# EAGLE design SaltwatersEchoCore (EAGLE 9.6.2)
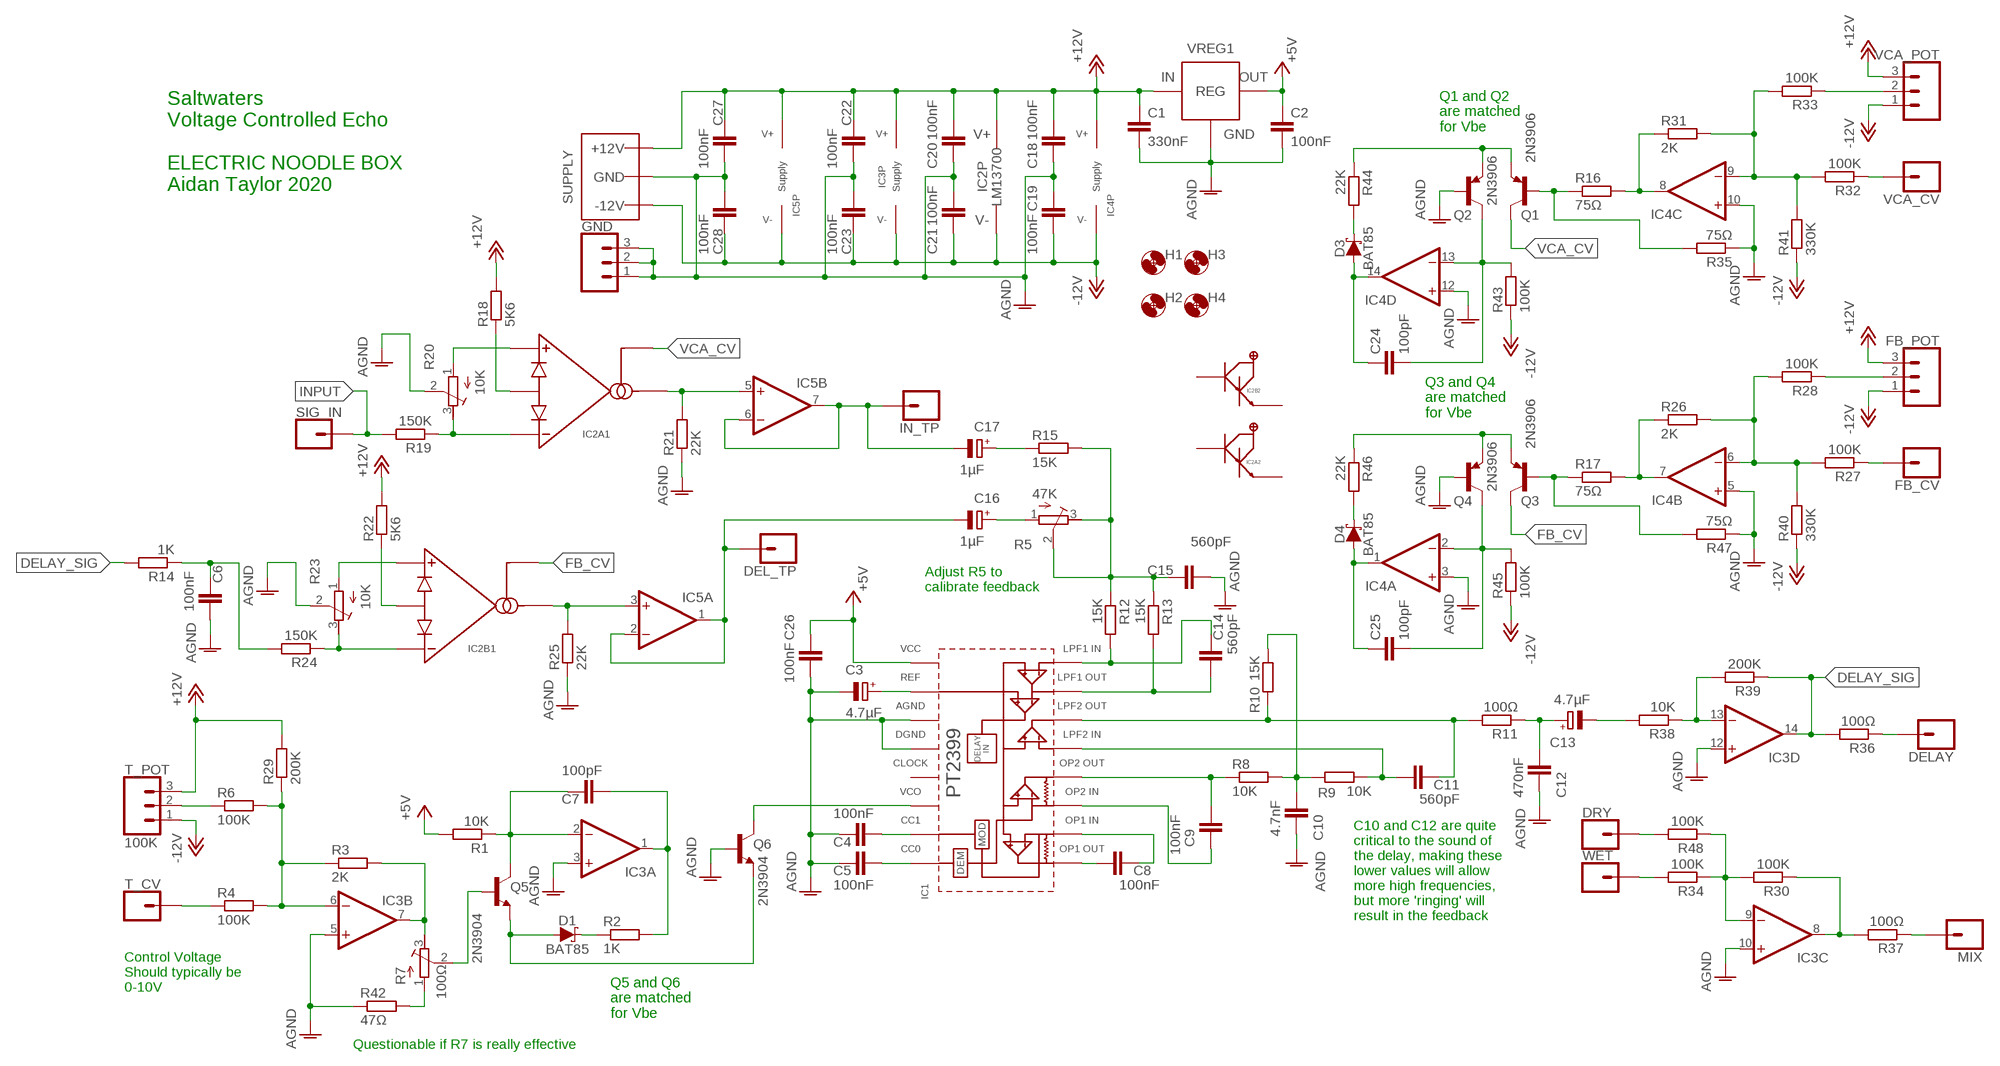
[diagram p0: schematic, sheet 1]

## Parts
C1  330nF  C-EU050-025X075  [C050-025X075]
C2  100nF  C-EU050-025X075  [C050-025X075]
C3  4.7µF  CPOL-EUE2-5  [E2-5]
C4  100nF  C-EU050-025X075  [C050-025X075]
C5  100nF  C-EU050-025X075  [C050-025X075]
C6  100nF  C-EU050-025X075  [C050-025X075]
C7  100pF  C-EU050-025X075  [C050-025X075]
C8  100nF  C-EU050-025X075  [C050-025X075]
C9  100nF  C-EU050-025X075  [C050-025X075]
C10  4.7nF  C-EU050-025X075  [C050-025X075]
C11  560pF  C-EU050-025X075  [C050-025X075]
C12  470nF  C-EU050-025X075  [C050-025X075]
C13  4.7µF  CPOL-EUE2-5  [E2-5]
C14  560pF  C-EU050-025X075  [C050-025X075]
C15  560pF  C-EU050-025X075  [C050-025X075]
C16  1µF  CPOL-EUE2-5  [E2-5]
C17  1µF  CPOL-EUE2-5  [E2-5]
C18  100nF  C-EU050-025X075  [C050-025X075]
C19  100nF  C-EU050-025X075  [C050-025X075]
C20  100nF  C-EU050-025X075  [C050-025X075]
C21  100nF  C-EU050-025X075  [C050-025X075]
C22  100nF  C-EU050-025X075  [C050-025X075]
C23  100nF  C-EU050-025X075  [C050-025X075]
C24  100pF  C-EU050-025X075  [C050-025X075]
C25  100pF  C-EU050-025X075  [C050-025X075]
C26  100nF  C-EU050-025X075  [C050-025X075]
C27  100nF  C-EU050-025X075  [C050-025X075]
C28  100nF  C-EU050-025X075  [C050-025X075]
D1  BAT85  SCHOTTKY_DO35  [DO35-7]
D3  BAT85  SCHOTTKY_DO35  [DO35-7]
D4  BAT85  SCHOTTKY_DO35  [DO35-7]
DEL_TP  1XWIREPAD  [1X01]
DELAY  1XWIREPAD  [1X01]
DRY  1XWIREPAD  [1X01]
FB_CV  1XWIREPAD  [1X01]
FB_POT  3XWIREPAD  [1X03]
GND  3XWIREPAD  [1X03]
H1  MOUNT-HOLE3.2  [3,2]
H2  MOUNT-HOLE3.2  [3,2]
H3  MOUNT-HOLE3.2  [3,2]
H4  MOUNT-HOLE3.2  [3,2]
IC1  PT2399DIL16  [DIL16]
IC2  LM13700DIL  [DIL16]
IC3  TL0X4DIL  [DIL14]
IC4  TL0X4DIL  [DIL14]
IC5  TL0X2DIL  [DIL08]
IN_TP  1XWIREPAD  [1X01]
MIX  1XWIREPAD  [1X01]
Q1  2N3906  [TO92]
Q2  2N3906  [TO92]
Q3  2N3906  [TO92]
Q4  2N3906  [TO92]
Q5  2N3904  [TO92]
Q6  2N3904  [TO92]
R1  10K  R-EU_0207/10  [0207/10]
R2  1K  R-EU_0207/10  [0207/10]
R3  2K  R-EU_0207/10  [0207/10]
R4  100K  R-EU_0207/10  [0207/10]
R5  47K  R-TRIMM3296W  [RTRIM3296W]
R6  100K  R-EU_0207/10  [0207/10]
R7  100Ω  R-TRIMM3296W  [RTRIM3296W]
R8  10K  R-EU_0207/10  [0207/10]
R9  10K  R-EU_0207/10  [0207/10]
R10  15K  R-EU_0207/10  [0207/10]
R11  100Ω  R-EU_0207/10  [0207/10]
R12  15K  R-EU_0207/10  [0207/10]
R13  15K  R-EU_0207/10  [0207/10]
R14  1K  R-EU_0207/10  [0207/10]
R15  15K  R-EU_0207/10  [0207/10]
R16  75Ω  R-EU_0207/10  [0207/10]
R17  75Ω  R-EU_0207/10  [0207/10]
R18  5K6  R-EU_0207/10  [0207/10]
R19  150K  R-EU_0207/10  [0207/10]
R20  10K  R-TRIMM3296W  [RTRIM3296W]
R21  22K  R-EU_0207/10  [0207/10]
R22  5K6  R-EU_0207/10  [0207/10]
R23  10K  R-TRIMM3296W  [RTRIM3296W]
R24  150K  R-EU_0207/10  [0207/10]
R25  22K  R-EU_0207/10  [0207/10]
R26  2K  R-EU_0207/10  [0207/10]
R27  100K  R-EU_0207/10  [0207/10]
R28  100K  R-EU_0207/10  [0207/10]
R29  200K  R-EU_0207/10  [0207/10]
R30  100K  R-EU_0207/10  [0207/10]
R31  2K  R-EU_0207/10  [0207/10]
R32  100K  R-EU_0207/10  [0207/10]
R33  100K  R-EU_0207/10  [0207/10]
R34  100K  R-EU_0207/10  [0207/10]
R35  75Ω  R-EU_0207/10  [0207/10]
R36  100Ω  R-EU_0207/10  [0207/10]
R37  100Ω  R-EU_0207/10  [0207/10]
R38  10K  R-EU_0207/10  [0207/10]
R39  200K  R-EU_0207/10  [0207/10]
R40  330K  R-EU_0207/10  [0207/10]
R41  330K  R-EU_0207/10  [0207/10]
R42  47Ω  R-EU_0207/10  [0207/10]
R43  100K  R-EU_0207/10  [0207/10]
R44  22K  R-EU_0207/10  [0207/10]
R45  100K  R-EU_0207/10  [0207/10]
R46  22K  R-EU_0207/10  [0207/10]
R47  75Ω  R-EU_0207/10  [0207/10]
R48  100K  R-EU_0207/10  [0207/10]
SIG_IN  1XWIREPAD  [1X01]
T_CV  1XWIREPAD  [1X01]
T_POT  100K  3XWIREPAD  [1X03]
VCA_CV  1XWIREPAD  [1X01]
VCA_POT  3XWIREPAD  [1X03]
VREG1  L78L05TO92  [TO92]
WET  1XWIREPAD  [1X01]
WP1  COMBO_SUPPLY_HEADER  [COMBINED_POWER]

## Nets
+5V: C2.1 C26.1 IC1.1(VCC) R1.2 VREG1.1(VOUT)
+12V: C1.1 C18.2 C20.2 C22.2 C27.2 FB_POT.3 IC2.11(P:V+) IC3.4(P:V+) IC4.4(P:V+) IC5.8(P:V+) R18.2 R22.2 R29.2 T_POT.3 VCA_POT.3 VREG1.3(VIN) WP1.V+1(V++) WP1.V+2(V++) WP1.V+3(V++)
-12V: C19.1 C21.1 C23.1 C28.1 FB_POT.1 IC2.6(P:V-) IC3.11(P:V-) IC4.11(P:V-) IC5.4(P:V-) R40.1 R41.1 R43.1 R45.1 T_POT.1 VCA_POT.1 WP1.V-1(V--) WP1.V-2(V--) WP1.V-3(V--)
AGND: C1.2 C2.2 C3.- C4.2 C5.2 C6.2 C10.1 C12.1 C15.2 C18.1 C19.2 C20.1 C21.2 C22.1 C23.2 C26.2 C27.1 C28.2 GND.1 GND.2 GND.3 IC1.3(AGND) IC1.4(DGND) IC3.3(A:+IN) IC3.5(B:+IN) IC3.10(C:+IN) IC3.12(D:+IN) IC4.3(A:+IN) IC4.5(B:+IN) IC4.10(C:+IN) IC4.12(D:+IN) Q2.2(B) Q4.2(B) Q6.2(B) R20.2(S) R21.1 R23.2(S) R25.1 R35.1 R42.1 R47.1 VREG1.2(GND) WP1.GND1(AGND) WP1.GND2(AGND) WP1.GND3(AGND) WP1.GND4(AGND) WP1.GND5(AGND) WP1.GND6(AGND) WP1.GND7(AGND) WP1.GND8(AGND)
DELAY_SIG: IC3.14(D:OUT) R14.2 R36.2 R39.1
FB_CV: IC2.16(B1:AMPBIAS) Q3.1(C)
FB_RTN: C16.- DEL_TP.1 IC5.1(A:OUT) IC5.2(A:-IN)
INPUT: R19.2 SIG_IN.1
N$1: C3.+ IC1.2(REF)
N$2: C4.1 IC1.7(CC1)
N$3: C5.1 IC1.8(CC0)
N$4: IC1.6(VCO) Q6.1(C)
N$5: C7.2 IC3.2(A:-IN) Q5.1(C) R1.1
N$6: C7.1 IC3.1(A:OUT) R2.2
N$7: D1.A Q5.3(E) Q6.3(E)
N$8: C6.1 R14.1 R24.2
N$9: D1.C R2.1
N$10: IC3.7(B:OUT) R3.2 R7.3(E)
N$11: Q5.2(B) R7.2(S)
N$12: R4.1 T_CV.1
N$13: IC3.6(B:-IN) R3.1 R4.2 R6.2 R29.1
N$14: R6.1 T_POT.2
N$15: C8.1 IC1.10(OP1_IN)
N$16: C8.2 IC1.9(OP1_OUT)
N$17: C9.1 IC1.11(OP2_IN)
N$18: C9.2 IC1.12(OP2_OUT) R8.1
N$19: C10.2 R8.2 R9.2 R10.1
N$20: C11.2 IC1.13(LPF2_IN) R9.1
N$21: C11.1 IC1.14(LPF2_OUT) R10.2 R11.2
N$22: Q1.2(B) R16.1 R35.2
N$23: C12.2 C13.+ R11.1
N$24: C14.1 IC1.16(LPF1_IN) R12.2
N$25: C14.2 IC1.15(LPF1_OUT) R13.2
N$26: C15.1 R5.2(S) R5.3(E) R12.1 R13.1 R15.2
N$27: C17.+ R15.1
N$28: C16.+ R5.1(A)
N$29: IC2.4(A1:AMP-) R19.1 R20.3(E)
N$30: IC2.3(A1:AMP+) R20.1(A)
N$31: IC4.7(B:OUT) R17.2 R26.1
N$32: IC2.2(A1:DIODES) R18.1
N$33: IC2.5(A1:AMPOUT) IC5.5(B:+IN) R21.2
N$34: C17.- IC5.6(B:-IN) IC5.7(B:OUT) IN_TP.1
N$35: DELAY.1 R36.1
N$36: IC2.15(B1:DIODES) R22.1
N$37: IC2.13(B1:AMP-) R23.3(E) R24.1
N$38: IC2.14(B1:AMP+) R23.1(A)
N$39: IC4.6(B:-IN) R26.2 R27.2 R28.2 R40.2
N$40: IC2.12(B1:AMPOUT) IC5.3(A:+IN) R25.2
N$41: Q3.2(B) R17.1 R47.2
N$42: DRY.1 R48.2
N$43: FB_CV.1 R27.1
N$44: IC4.8(C:OUT) R16.2 R31.1
N$45: FB_POT.2 R28.1
N$46: IC4.9(C:-IN) R31.2 R32.2 R33.2 R41.2
N$47: C24.1 D3.A IC4.14(D:OUT)
N$48: C24.2 IC4.13(D:-IN) Q2.1(C) R43.2
N$49: R32.1 VCA_CV.1
N$50: R33.1 VCA_POT.2
N$51: C13.- R38.2
N$52: R34.2 WET.1
N$53: MIX.1 R37.1
N$54: R7.1(A) R42.2
N$55: IC3.9(C:-IN) R30.2 R34.1 R48.1
N$56: IC3.8(C:OUT) R30.1 R37.2
N$57: D3.C R44.2
N$58: Q1.3(E) Q2.3(E) R44.1
N$59: IC3.13(D:-IN) R38.1 R39.2
N$60: C25.2 IC4.2(A:-IN) Q4.1(C) R45.2
N$61: C25.1 D4.A IC4.1(A:OUT)
N$62: D4.C R46.2
N$63: Q3.3(E) Q4.3(E) R46.1
VCA_CV: IC2.1(A1:AMPBIAS) Q1.1(C)
Unconnected: IC1.5(CLOCK) IC2.7(A2:BUFF_IN) IC2.8(A2:BUFF_OUT) IC2.9(B2:BUFF_OUT) IC2.10(B2:BUFF_IN)

## Notes on the sheet
- Saltwaters
  Voltage Controlled Echo
  
  ELECTRIC NOODLE BOX
  Aidan Taylor 2020
- Q1 and Q2
  are matched
  for Vbe
- Q3 and Q4
  are matched
  for Vbe
- Adjust R5 to
  calibrate feedback
- C10 and C12 are quite 
  critical to the sound of 
  the delay, making these
  lower values will allow
  more high frequencies,
  but more 'ringing' will
  result in the feedback
- Q5 and Q6
  are matched
  for Vbe
- Control Voltage
  Should typically be
  0-10V
- Questionable if R7 is really effective

## Library data of the parts
C1 C2 C4-C12 C14 C15 C18-C28 = rcl:C-EU: CAPACITOR, European symbol; SPICEPREFIX: C
C3 C13 C16 C17 = rcl:CPOL-EU: POLARIZED CAPACITOR, European symbol; SPICEPREFIX: C
D1 D3 D4 = ElectricNoodleBox:SCHOTTKY_DO35
DEL_TP DELAY DRY FB_CV IN_TP MIX SIG_IN T_CV VCA_CV WET = ElectricNoodleBox:1XWIREPAD
FB_POT GND T_POT VCA_POT = ElectricNoodleBox:3XWIREPAD
H1-H4 = holes:MOUNT-HOLE: MOUNTING HOLE with drill center marker
IC1 = ElectricNoodleBox:PT2399
IC2 = ElectricNoodleBox:LM13700: Dual Transconductance Amplifier with Darlington Buffer; CATALOGUE: 3118206; RETAILER: Farnell
IC3 IC4 = ElectricNoodleBox:TL0X4: Quad Operational Amplifier; CATALOGUE: 3005140; RETAILER: Farnell
IC5 = ElectricNoodleBox:TL0X2: Dual Operational Amplifier; CATALOGUE: 1103189; RETAILER: Farnell
Q1-Q4 = transistor-pnp:2N3906: PNP Transistor
Q5 Q6 = transistor:2N3904: NPN TRANSISTOR
R1-R4 R6 R8-R19 R21 R22 R24-R48 = rcl:R-EU_: RESISTOR, European symbol; SPICEPREFIX: R
R5 R7 R20 R23 = rcl:R-TRIMM: Trimm resistor; SPICEMODEL: X; SPICEPREFIXL: POT
VREG1 = ElectricNoodleBox:L78L05
WP1 = ElectricNoodleBox:COMBO_SUPPLY_HEADER

## Board
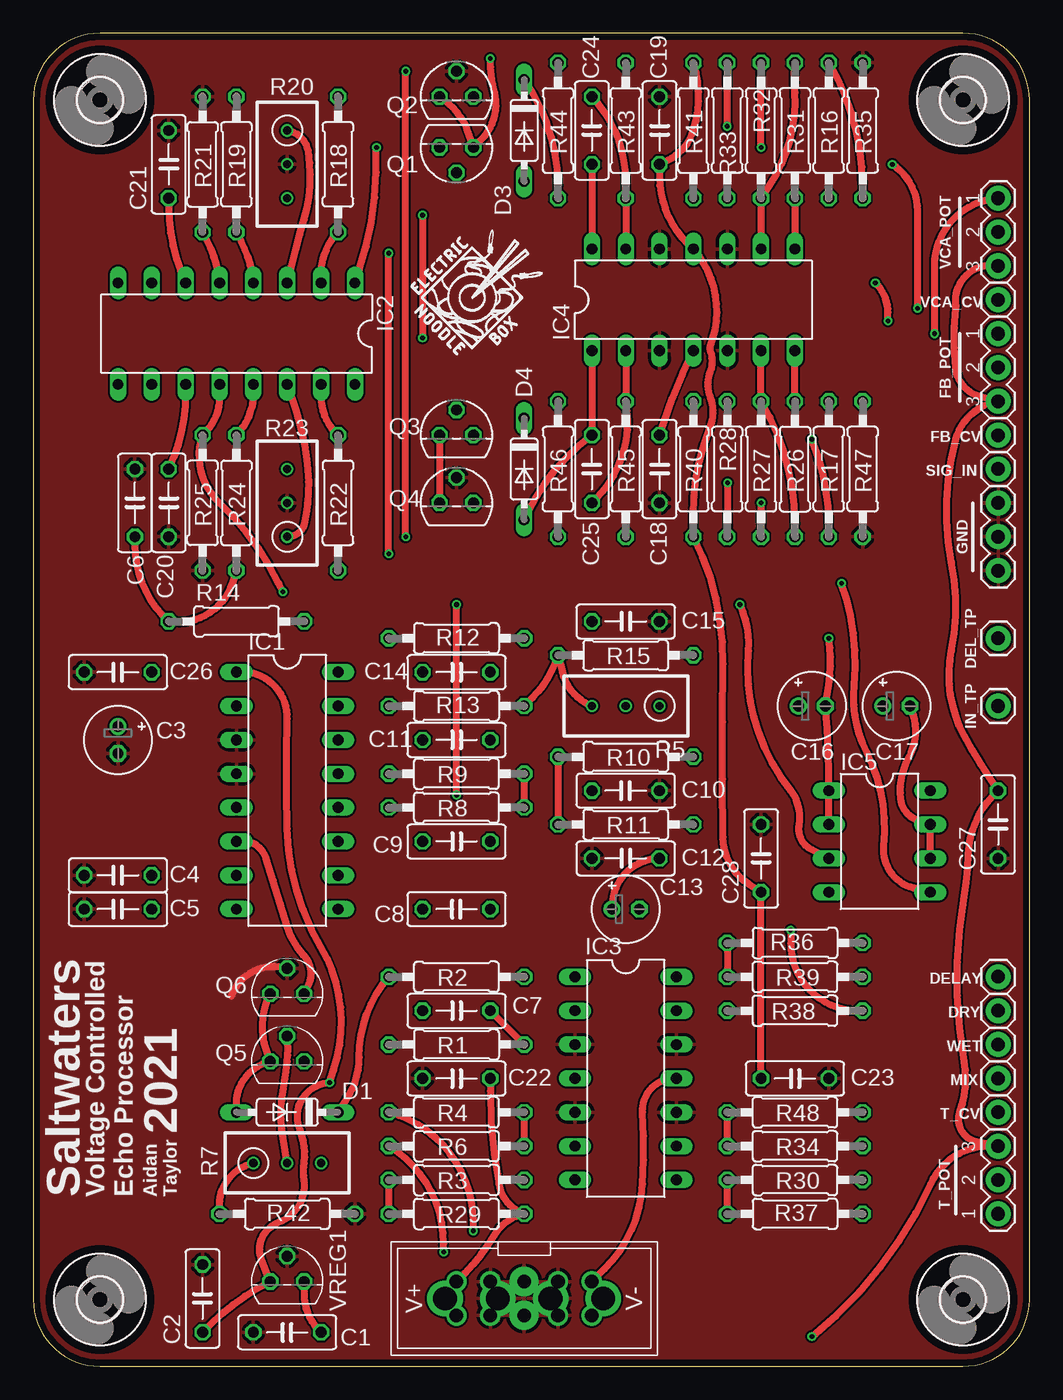
[diagram p1: board, top side]
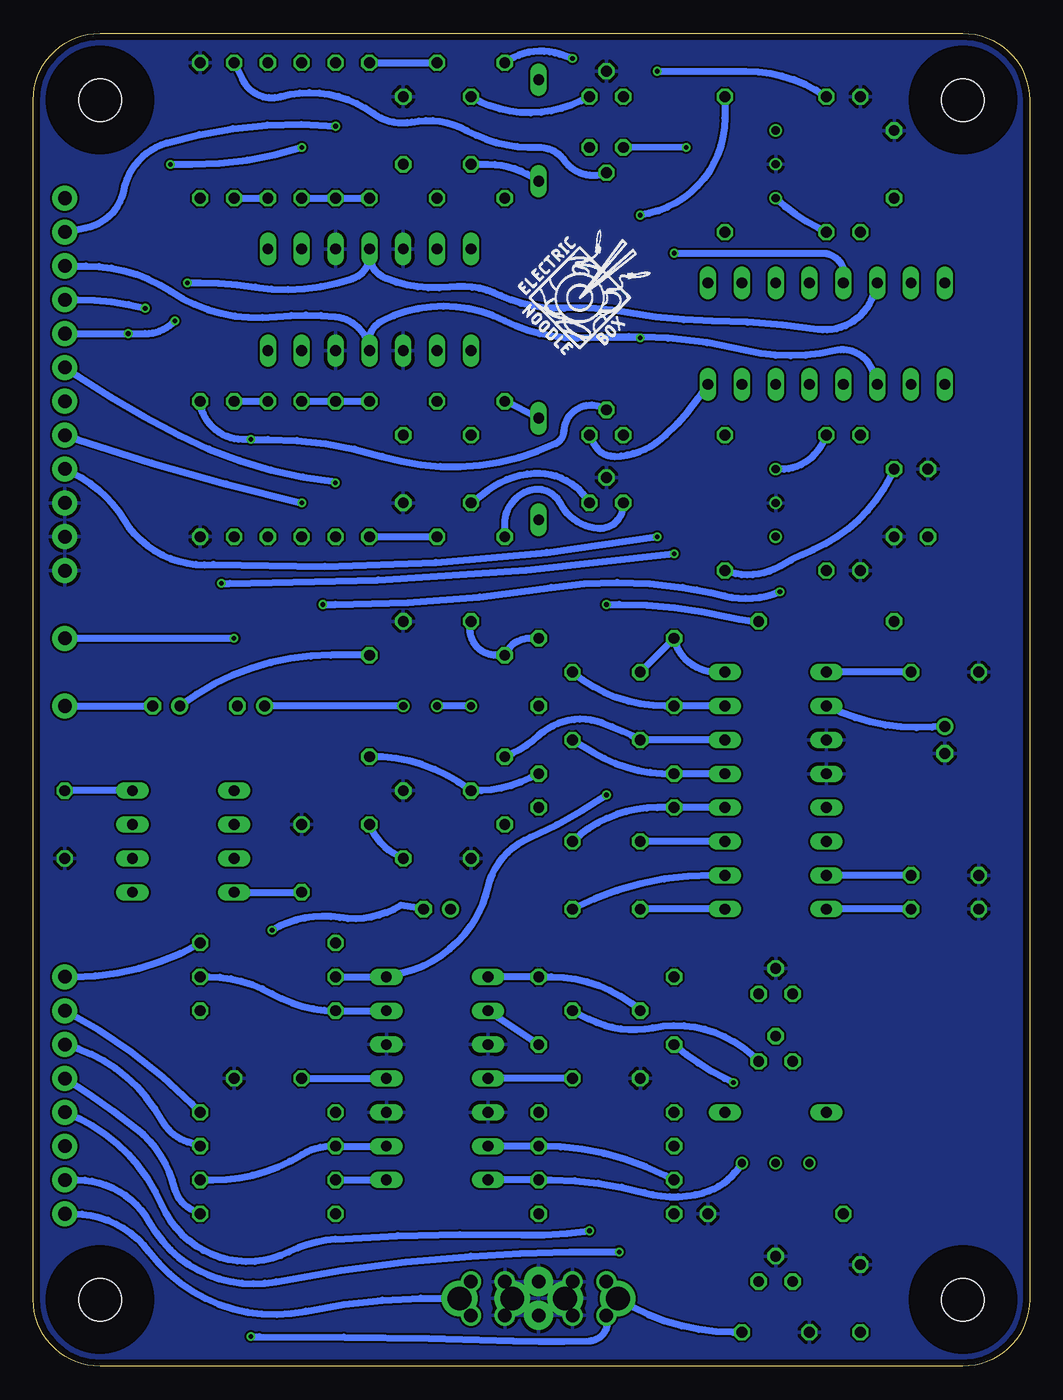
[diagram p2: board, bottom side, seen from below]

Size 74.75 x 100 mm. Coordinates in mm from the lower left corner, seen from the top.
Outline: 0,95 0,5 arc90 5,0 69.75,0 arc90 74.75,5 74.75,95 arc90 69.75,100 5,100 arc90 0,95
Copper layers (1*16): Top 0.035mm / dielectric 1.6mm / Bottom 0.035mm
Design rules "Elecrow_2-layer_PCB_eagle_rule": minimum track width 6mil, minimum drill 12mil, track to track 6mil, track to pad 6mil, pad to pad 6mil, via to via 8mil, smd to smd 0mil, copper to edge 20mil, drill to drill 10mil, minimum pad ring 6mil, minimum via ring 6mil, stop-mask expansion 0mil, vias tented up to drill 100mil, thermal gap 10mil

### Footprints (pad centres in the part's own frame; a part is rotated, then mirrored left to right if it is on the bottom)
C050-025X075 = drill 0.813 octagon: 1 -2.54,0; 2 2.54,0
E2-5 = drill 0.813 pad 1.27: + -1.016,0 | drill 0.813 pad 1.27 octagon: - 1.016,0
DO35-7 = drill 0.813 long: A 3.81,0; C -3.81,0
1X01 = drill 1.016 pad 1.88: 1 0,0
1X03 = drill 1.016 pad 1.88: 1 0,0; 2 2.54,0; 3 5.08,0
3,2 = hole 3.2: 0,0
DIL16 = drill 0.813 long: 1 -8.89,-3.81; 2 -6.35,-3.81; 3 -3.81,-3.81; 4 -1.27,-3.81; 5 1.27,-3.81; 6 3.81,-3.81; 7 6.35,-3.81; 8 8.89,-3.81; 9 8.89,3.81; 10 6.35,3.81; 11 3.81,3.81; 12 1.27,3.81; 13 -1.27,3.81; 14 -3.81,3.81; 15 -6.35,3.81; 16 -8.89,3.81
DIL14 = drill 0.813 long: 1 -7.62,-3.81; 2 -5.08,-3.81; 3 -2.54,-3.81; 4 0,-3.81; 5 2.54,-3.81; 6 5.08,-3.81; 7 7.62,-3.81; 8 7.62,3.81; 9 5.08,3.81; 10 2.54,3.81; 11 0,3.81; 12 -2.54,3.81; 13 -5.08,3.81; 14 -7.62,3.81
DIL08 = drill 0.813 long: 1 -3.81,-3.81; 2 -1.27,-3.81; 3 1.27,-3.81; 4 3.81,-3.81; 5 3.81,3.81; 6 1.27,3.81; 7 -1.27,3.81; 8 -3.81,3.81
TO92 = drill 0.813 octagon: 1 1.27,0; 2 0,1.905; 3 -1.27,0
0207/10 = drill 0.813 octagon: 1 -5.08,0; 2 5.08,0
RTRIM3296W = drill 0.61: 1 0,-2.54; 2 0,0; 3 0,2.54
TO92' = drill 0.813 octagon: 1 -1.27,0; 2 0,1.905; 3 1.27,0
COMBINED_POWER = drill 1.78: GND1 -1.98,0; GND2 1.98,0; V+1 -5.94,0; V-1 5.94,0 | drill 1.016: GND3 -2.54,1.27; GND5 2.54,1.27; GND6 -2.54,-1.27; GND8 2.54,-1.27; V+2 -5.08,1.27; V+3 -5.08,-1.27; V-2 5.08,1.27; V-3 5.08,-1.27 | drill 1.016 pad 2.184: GND4 0,1.27; GND7 0,-1.27

### Placement (x,y rotation side)
C1  19.05,2.54 180 top
C2  12.7,5.08 90 top
C3  6.35,46.99 270 top
C4  6.35,36.83 180 top
C5  6.35,34.29 180 top
C6  7.62,64.77 90 top
C7  31.75,26.67 0 top
C8  31.75,34.29 180 top
C9  31.75,39.37 0 top
C10  44.45,43.18 180 top
C11  31.75,46.99 0 top
C12  44.45,38.1 0 top
C13  44.45,34.29 0 top
C14  31.75,52.07 0 top
C15  44.45,55.88 0 top
C16  58.42,49.53 0 top
C17  64.77,49.53 0 top
C18  46.99,67.31 90 top
C19  46.99,92.71 90 top
C20  10.16,64.77 90 top
C21  10.16,90.17 90 top
C22  31.75,21.59 0 top
C23  57.15,21.59 0 top
C24  41.91,92.71 90 top
C25  41.91,67.31 270 top
C26  6.35,52.07 180 top
C27  72.39,40.64 90 top
C28  54.61,38.1 90 top
D1  19.05,19.05 180 top
D3  36.83,92.71 270 top
D4  36.83,67.31 270 top
DEL_TP  72.39,54.61 0 top
DELAY  72.39,29.21 0 top
DRY  72.39,26.67 0 top
FB_CV  72.39,69.85 0 top
FB_POT  72.39,77.47 270 top
GND  72.39,64.77 270 top
H1  69.75,95 0 top
H2  5,95 0 top
H3  69.75,5 0 top
H4  5,5 0 top
IC1  19.05,43.18 270 top
IC2  15.24,77.47 180 top
IC3  44.45,21.59 270 top
IC4  49.53,80.01 0 top
IC5  63.5,39.37 270 top
IN_TP  72.39,49.53 0 top
MIX  72.39,21.59 0 top
Q1  31.75,91.44 180 top
Q2  31.75,95.25 0 top
Q3  31.75,69.85 0 top
Q4  31.75,64.77 0 top
Q5  19.05,22.86 0 top
Q6  19.05,27.94 0 top
R1  31.75,24.13 180 top
R2  31.75,29.21 0 top
R3  31.75,13.97 0 top
R4  31.75,19.05 0 top
R5  44.45,49.53 90 top
R6  31.75,16.51 0 top
R7  19.05,15.24 270 top
R8  31.75,41.91 0 top
R9  31.75,44.45 0 top
R10  44.45,45.72 180 top
R11  44.45,40.64 180 top
R12  31.75,54.61 180 top
R13  31.75,49.53 180 top
R14  15.24,55.88 0 top
R15  44.45,53.34 180 top
R16  59.69,92.71 270 top
R17  59.69,67.31 90 top
R18  22.86,90.17 90 top
R19  15.24,90.17 90 top
R20  19.05,90.17 180 top
R21  12.7,90.17 270 top
R22  22.86,64.77 270 top
R23  19.05,64.77 0 top
R24  15.24,64.77 270 top
R25  12.7,64.77 90 top
R26  57.15,67.31 270 top
R27  54.61,67.31 90 top
R28  52.07,67.31 90 top
R29  31.75,11.43 0 top
R30  57.15,13.97 0 top
R31  57.15,92.71 90 top
R32  54.61,92.71 270 top
R33  52.07,92.71 270 top
R34  57.15,16.51 0 top
R35  62.23,92.71 270 top
R36  57.15,31.75 180 top
R37  57.15,11.43 180 top
R38  57.15,26.67 0 top
R39  57.15,29.21 0 top
R40  49.53,67.31 90 top
R41  49.53,92.71 270 top
R42  19.05,11.43 180 top
R43  44.45,92.71 270 top
R44  39.37,92.71 270 top
R45  44.45,67.31 90 top
R46  39.37,67.31 90 top
R47  62.23,67.31 90 top
R48  57.15,19.05 0 top
SIG_IN  72.39,67.31 0 top
T_CV  72.39,19.05 0 top
T_POT  72.39,11.43 90 top
U$1  [LOGO10X10]  28.26,75.56 0 top
U$2  [LOGO10X10]  38.42,75.56 0 bottom
VCA_CV  72.39,80.01 0 top
VCA_POT  72.39,87.63 270 top
VREG1  [TO92']  19.05,6.35 0 top
WET  72.39,24.13 0 top
WP1  36.83,5.08 0 top

### Tracks (layer width: path | path; a pad name or v marks a point on that pad's centre or on a via)
+5V  (via drill 0.35)
  Top 0.508: C2.1 13.34,3.17 arc-19 VREG1.1 17.14,7.94 arc-92 18.41,10.79 arc78 20.32,13.97 arc-16 20.32,15.24 arc30 20,17.78 arc-109 v22.23,21.27 22.54,22.23 arc49 21.59,31.43 arc-29 19.05,40.32 arc-3 19.05,48.58 arc98 IC1.1
  Bottom 0.508: v22.23,21.27 22.86,21.59 arc14 R1.2 | C26.1 IC1.1
+12V  (via drill 0.35)
  Top 0.508: v58.42,2.22 arc27 67.31,13.65 arc-65 71.75,16.51 T_POT.3 70.8,16.83 arc-98 69.53,19.05 arc29 69.85,22.86 arc-19 69.85,35.24 arc8 70.17,38.42 arc-47 C27.2 71.75,44.13 arc-5 69.85,47.31 arc-39 68.9,53.66 arc22 68.9,60.33 arc-26 69.22,69.53 arc-66 FB_POT.3 71.12,72.71 arc-71 69.22,74.93 arc-10 69.22,79.38 arc10 69.22,79.69 arc-107 VCA_POT.3 | C18.2 47.31,70.8 arc-8 IC4.4 | C22.2 34.29,20.64 arc10 34.92,13.65 arc60 R29.2 arc47 34.61,9.84 arc-14 32.38,6.99 WP1.V+2 | VREG1.3 20.32,5.4 arc48 C1.1 | IC2.11 11.43,73.03 arc-25 C20.2 | v29.21,86.36 v29.21,77.15
  Bottom 0.508: v58.42,2.22 57.78,2.22 arc2 38.73,1.91 arc-4 33.02,1.91 arc-109 WP1.V+3 WP1.V+1 | WP1.V+1 WP1.V+2 | IC5.8 C27.2 | VCA_POT.3 70.8,82.55 arc33 64.45,80.64 arc-40 56.52,78.74 arc13 52.07,78.74 arc77 IC4.4 arc80 48.58,78.42 arc54 39.37,78.42 arc-31 33.02,77.15 | C22.2 IC3.4 | C1.1 22.23,2.54 arc33 WP1.V+1 | C20.2 10.48,66.67 arc40 16.19,61.28 arc-7 18.73,60.01 arc51 R22.2 | IC2.11 11.75,74.61 arc-85 14.61,76.2 arc27 21.27,76.2 arc-18 33.02,77.15 | R18.2 22.86,93.66 arc82 v29.21,86.36 | v29.21,77.15 33.02,77.15
-12V  (via drill 0.35)
  Top 0.508: VCA_POT.1 arc86 67.63,82.55 v67.63,77.47 | v64.14,78.42 64.14,79.06 arc46 v63.18,81.28 | R41.1 arc-36 49.53,92.71 arc-46 47.62,90.49 C19.1 46.99,89.22 arc50 IC4.11 arc-63 50.8,76.52 arc43 50.8,76.2 arc-43 50.8,74.61 arc43 50.8,72.71 arc-43 50.8,70.48 arc22 49.53,63.82 R40.1 arc-28 51.75,52.7 arc2 51.75,39.69 arc55 53.66,36.2 C28.1 C23.1 | WP1.V-2 42.86,7.3 arc42 45.72,13.65 arc7 45.72,19.05 arc-97 IC3.11 | C21.1 10.16,87 arc25 IC2.6
  Bottom 0.508: T_POT.1 71.75,11.43 arc53 66.04,8.57 arc-65 54.29,4.13 arc14 WP1.V-1 | WP1.V-2 WP1.V-1 | WP1.V-1 WP1.V-3 | FB_POT.1 v67.63,77.47 66.36,77.47 arc-46 v64.14,78.42 | v63.18,81.28 62.23,81.28 arc9 58.1,80.96 arc-28 50.8,81.6 arc-83 IC4.11 arc-77 48.26,81.6 arc-29 43.5,80.96 arc32 39.69,80.33 arc-29 34.92,79.38 arc14 30.16,79.06 arc-10 23.81,78.42 arc8 15.88,77.79 arc-80 11.75,80.33 IC2.6 | C23.1 IC3.11 | IC5.4 C28.1 | R40.1 R45.1 | R41.1 R43.1
AGND
  Top 0.508: 14.88,27.76 arc-88 Q6.2
  pour Top: 0,0 74.75,0 74.75,100 0,100
  pour Bottom: 0,0 74.75,0 74.75,100 0,100
DELAY_SIG  (via drill 0.35)
  Top 0.508: R36.2 R39.1 | v31.75,42.86 v31.75,57.15
  Bottom 0.508: R39.1 IC3.14 46.99,29.53 arc-41 41.91,33.02 arc-22 40.64,35.88 arc54 37.47,39.69 arc-12 v31.75,42.86 | v31.75,57.15 30.8,57.15 arc13 22.54,56.2 arc-10 R14.2
FB_CV
  Bottom 0.508: Q3.1 32.7,69.22 arc-65 31.11,68.26 arc-42 27.3,69.85 arc-13 IC2.16
FB_RTN  (via drill 0.35)
  Top 0.508: IC5.2 IC5.1 59.69,44.45 arc6 C16.- 59.69,51.12 arc18 v59.69,54.61
  Bottom 0.508: v59.69,54.61 DEL_TP.1
INPUT  (via drill 0.35)
  Top 0.508: v27.94,62.23 v27.94,97.16
  Bottom 0.508: SIG_IN.1 71.75,66.99 arc32 67.94,63.5 arc-64 61.24,60.15 arc-12 v27.94,62.23 | R19.2 arc-35 21.27,97.16 v27.94,97.16
N$1
  Bottom 0.508: C3.+ 7.3,47.94 arc30 IC1.2
N$2
  Bottom 0.508: C4.1 IC1.7
N$3
  Bottom 0.508: C5.1 IC1.8
N$4
  Top 0.508: Q6.1 20.64,28.57 arc69 20.32,30.8 arc-26 19.05,33.02 arc1 17.46,38.1 arc84 IC1.6
N$5
  Top 0.508: C7.2 R1.1
  Bottom 0.508: R1.1 IC3.2 | C7.2 33.02,26.04 arc-38 28.26,25.4 arc58 Q5.1
N$6
  Bottom 0.508: IC3.1 R2.2 35.88,29.21 arc42 C7.1
N$7
  Top 0.508: D1.A 15.24,19.68 arc-77 Q5.3 17.46,23.81 arc-46 Q6.3
N$8
  Top 0.508: R24.2 14.92,58.74 arc-81 R14.1 arc-48 7.62,61.59 C6.1
N$9
  Top 0.508: D1.C 23.5,20 arc34 24.45,23.18 arc-41 R2.1
N$10
  Bottom 0.508: IC3.7 R3.2 35.88,13.97 arc16 28.89,13.02 arc-31 24.45,13.02 arc-45 R7.3
N$11
  Top 0.508: R7.2 18.73,17.14 arc-19 18.73,20.64 arc3 19.05,22.86 arc14 Q5.2
N$12  (via drill 0.35)
  Top 0.508: v33.02,10.16 33.02,10.79 arc75 R4.1
  Bottom 0.508: v33.02,10.16 arc10 38.1,9.84 arc-6 52.07,9.53 arc-22 55.56,8.57 arc93 65.09,12.06 arc-46 T_CV.1
N$13
  Top 0.508: R3.1 R29.1 | R4.2 R6.2
  Bottom 0.508: IC3.6 R6.2 arc27 27.3,14.29 R3.1
N$14  (via drill 0.35)
  Top 0.508: v30.8,8.57 30.8,9.21 arc59 R6.1
  Bottom 0.508: T_POT.2 71.44,13.97 arc61 66.04,10.79 arc-72 56.52,6.35 arc7 41.91,8.26 arc5 v30.8,8.57
N$15
  Bottom 0.508: IC1.10 23.81,36.83 arc-27 C8.1
N$16
  Bottom 0.508: IC1.9 C8.2
N$17
  Bottom 0.508: IC1.11 C9.1
N$18
  Bottom 0.508: C9.2 arc44 27.94,41.91 R8.1 IC1.12
N$19
  Top 0.508: R9.2 R8.2
  Bottom 0.508: R9.2 37.47,44.13 arc29 C10.2 42.86,43.81 arc-35 R10.1
N$20
  Bottom 0.508: C11.2 32.7,46.04 arc-32 R9.1 IC1.13
N$21
  Top 0.508: R10.2 R11.2
  Bottom 0.508: IC1.14 C11.1 29.84,47.31 arc-7 32.07,48.26 arc-62 36.83,47.31 arc21 R10.2
N$22
  Top 0.508: R35.2 62.23,88.58 arc31 R16.1
  Bottom 0.508: R16.1 59.05,96.52 arc-79 56.2,95.25 arc52 49.21,93.98 arc-47 46.35,93.34 arc40 42.23,92.71 arc-31 36.83,91.44 arc57 34.92,90.49 arc-77 Q1.2
N$23
  Top 0.508: C13.+ 43.5,34.92 arc-84 C12.2
  Bottom 0.508: C12.2 arc46 R11.1
N$24
  Bottom 0.508: IC1.16 23.5,52.07 arc77 R12.2 C14.1
N$25
  Bottom 0.508: C14.2 arc-40 27.3,49.53 R13.2 IC1.15
N$26
  Top 0.508: R13.1 37.47,50.16 arc28 R15.2 39.69,52.07 arc54 R5.3
  Bottom 0.508: R12.1 37.47,54.61 arc-67 R15.2 40.01,53.34 arc106 C15.1 | R5.3 R5.2
N$27
  Bottom 0.508: R15.1 52.42,53.34 arc-37 C17.+
N$28
  Bottom 0.508: R5.1 C16.+
N$29
  Top 0.508: R19.1 15.56,84.45 arc-20 IC2.4
  Bottom 0.508: R19.1 15.88,85.41 arc17 R20.3
N$30
  Top 0.508: IC2.3 19.37,82.55 arc-2 20.32,86.04 arc26 20.64,91.12 arc71 R20.1
N$31
  Top 0.508: R26.1 IC4.7
  Bottom 0.508: R17.2 R26.1
N$32
  Top 0.508: IC2.2 21.59,81.92 arc-44 R18.1
N$33  (via drill 0.35)
  Top 0.508: IC5.5 66.04,35.88 arc-82 63.82,39.05 arc33 62.55,46.04 arc-32 61.59,51.12 arc25 v60.64,58.74 | v26.67,60.96 v26.67,83.5 | R21.2 13.02,84.45 arc-20 IC2.5
  Bottom 0.508: v60.64,58.74 60.01,58.74 arc-8 v26.67,60.96 | v26.67,83.5 15.56,83.5 arc109 IC2.5
N$34
  Top 0.508: IC5.6 IC5.7 66.36,40.96 arc-66 65.09,42.55 arc-34 65.72,45.72 arc55 C17.-
  Bottom 0.508: IN_TP.1 C17.-
N$35
  Bottom 0.508: DELAY.1 71.75,29.21 arc-30 R36.1
N$36
  Top 0.508: IC2.15 21.59,72.71 arc48 R22.1
N$37
  Top 0.508: IC2.13 16.51,73.03 arc-44 R24.1
  Bottom 0.508: R24.1 15.56,69.22 arc70 R23.3
N$38
  Top 0.508: IC2.14 19.68,71.75 arc-17 20.64,66.36 arc-15 20.32,63.18 arc-80 R23.1
N$39
  Top 0.508: R26.2 57.15,63.18 arc31 R27.2 IC4.6
  Bottom 0.508: R27.2 R28.2 R40.2
N$40  (via drill 0.35)
  Top 0.508: IC5.3 58.42,38.73 arc-74 57.47,40.64 arc49 56.83,43.18 arc-43 53.66,53.66 arc30 v53.02,57.15 | v18.73,58.1 18.41,58.74 arc20 13.97,64.77 arc-64 R25.2 arc48 13.97,72.71 IC2.12
  Bottom 0.508: v53.02,57.15 52.07,57.15 arc-9 35.88,58.42 arc18 26.04,58.42 arc5 22.86,57.78 arc-36 v18.73,58.1
N$41  (via drill 0.35)
  Top 0.508: R17.1 59.69,63.18 arc23 v58.42,69.53
  Bottom 0.508: Q3.2 arc-122 34.92,70.17 arc62 35.56,69.22 arc42 48.58,68.26 arc-17 57.15,69.53 v58.42,69.53 59.05,69.53 arc84 R47.2
N$42
  Bottom 0.508: R48.2 62.87,19.68 arc-17 DRY.1
N$43  (via drill 0.35)
  Top 0.508: v54.61,64.77 R27.1
  Bottom 0.508: FB_CV.1 71.44,69.53 arc-5 v54.61,64.77
N$44
  Top 0.508: R31.1 IC4.8
  Bottom 0.508: R16.2 R31.1
N$45  (via drill 0.35)
  Top 0.508: v52.1,66.27 R28.1
  Bottom 0.508: FB_POT.2 71.44,74.3 arc-7 63.82,69.85 arc-21 52.07,66.36 arc201 v52.1,66.27
N$46
  Top 0.508: IC4.9 R32.2 55.24,88.58 arc37 57.15,95.57 arc-6 R31.2
  Bottom 0.508: R32.2 R33.2 R41.2
N$47
  Top 0.508: C24.1 IC4.14
  Bottom 0.508: C24.1 40.64,90.17 arc37 D3.A
N$48
  Top 0.508: IC4.13 R43.2 44.45,88.9 arc44 C24.2
  Bottom 0.508: Q2.1 33.66,94.93 arc58 C24.2
N$49  (via drill 0.35)
  Top 0.508: v66.36,79.38 66.36,86.68 arc57 v64.45,90.17 | v54.61,91.44 R32.1
  Bottom 0.508: VCA_CV.1 71.44,80.01 arc14 v66.36,79.38 | v64.45,90.17 62.87,90.17 arc-17 v54.61,91.44
N$50  (via drill 0.35)
  Top 0.508: v52.07,93.03 R33.1
  Bottom 0.508: VCA_POT.2 70.8,85.41 arc-67 67.94,88.27 arc62 64.77,91.76 arc22 v52.07,93.03
N$51  (via drill 0.35)
  Top 0.508: v56.83,32.7 56.83,31.75 arc93 R38.2
  Bottom 0.508: C13.- 47.17,34.57 arc41 51.75,33.66 arc-40 v56.83,32.7
N$52
  Bottom 0.508: R34.2 63.18,16.83 arc43 65.09,18.41 arc-46 WET.1
N$53
  Bottom 0.508: R37.1 62.87,11.75 arc50 64.14,13.34 arc-38 66.99,17.78 arc-6 MIX.1
N$54
  Top 0.508: R42.2 13.97,12.06 arc-77 R7.1
N$55
  Top 0.508: R34.1 R48.1
  Bottom 0.508: R30.2 61.28,13.97 arc-32 54.61,15.88 arc36 R34.1 IC3.9
N$56
  Top 0.508: R37.2 R30.1
  Bottom 0.508: R30.1 IC3.8
N$57
  Top 0.508: R44.2 39.37,88.58 arc35 D3.C
N$58  (via drill 0.35)
  Top 0.508: Q2.3 arc-39 32.7,92.39 Q1.3 33.66,92.08 arc59 34.61,95.57 arc-15 v34.29,98.11
  Bottom 0.508: v34.29,98.11 35.24,98.42 arc-54 R44.1
N$59
  Bottom 0.508: R39.2 61.59,29.21 arc30 56.83,27.94 arc-30 R38.1 IC3.13
N$60
  Top 0.508: IC4.2 R45.2 arc-56 42.23,65.09 C25.2
  Bottom 0.508: C25.2 40.64,65.72 arc34 37.15,66.99 arc63 Q4.1
N$61
  Top 0.508: IC4.1 C25.1 arc26 37.15,64.14 D4.A
N$62
  Bottom 0.508: D4.C R46.2
N$63
  Top 0.508: Q3.3 Q4.3
  Bottom 0.508: R46.1 39.37,63.18 arc74 37.47,65.72 arc79 35.24,64.77 arc-58 32.38,62.87 arc-99 Q4.3
VCA_CV  (via drill 0.35)
  Top 0.508: IC2.1 24.45,82.23 arc21 25.72,91.44 arc-201 v25.76,91.43
  Bottom 0.508: v25.76,91.43 Q1.1

### Text on the board
tPlace: 1 | 2 | 3 | 1 | 2 | 3 | 2021 | 3 | 2 | Saltwaters | Voltage Controlled / Echo Processor | Aidan / Taylor | 1